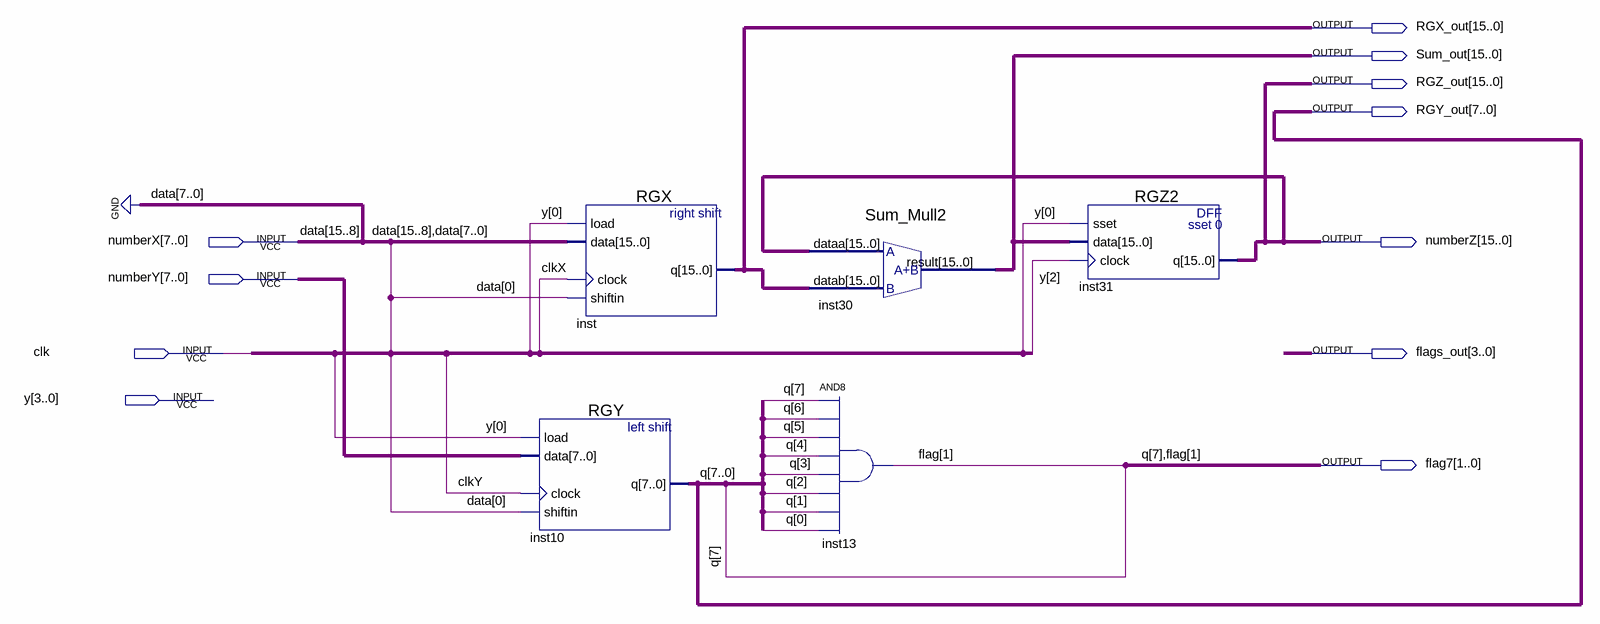
[diagram p0: schematic sheet]
// Quartus schematic Mull_ASINHR.bdf as structural Verilog: 5 symbols, 11 pins
module Mull_ASINHR (
  input  [7:0] numberX,
  input  [7:0] numberY,
  input  clk,
  input  [3:0] y,
  output [15:0] RGX_out,
  output [15:0] Sum_out,
  output [15:0] RGZ_out,
  output [7:0] RGY_out,
  output [15:0] numberZ,
  output [3:0] flags_out,
  output [1:0] flag7
);

  wire clkX, clkY;

  RGY inst10 (.load(y[0]), .data(numberY), .clock(clkY), .shiftin(1'b0), .q({flag7[1], RGY_out[6:0]}));
  RGX inst (.load(y[0]), .data({numberX, {8{1'b0}}}), .clock(clkX), .shiftin(1'b0), .q(RGX_out));
  Sum_Mull2 inst30 (.dataa(numberZ), .datab(RGX_out), .result(Sum_out));
  and inst13 (flag7[0], flag7[1], RGY_out[6], RGY_out[5], RGY_out[4], RGY_out[3], RGY_out[2], RGY_out[1], RGY_out[0]);
  RGZ2 inst31 (.sset(y[0]), .data(Sum_out), .clock(y[2]), .q(numberZ));

  assign RGY_out[7] = flag7[1];
  assign RGZ_out = numberZ;

  // Other names for the same wires on the sheet: data[15:8] = numberX; flag[1] = flag7[0];
  //   q[7:0] = {flag7[1], RGY_out[6:0]}
endmodule
